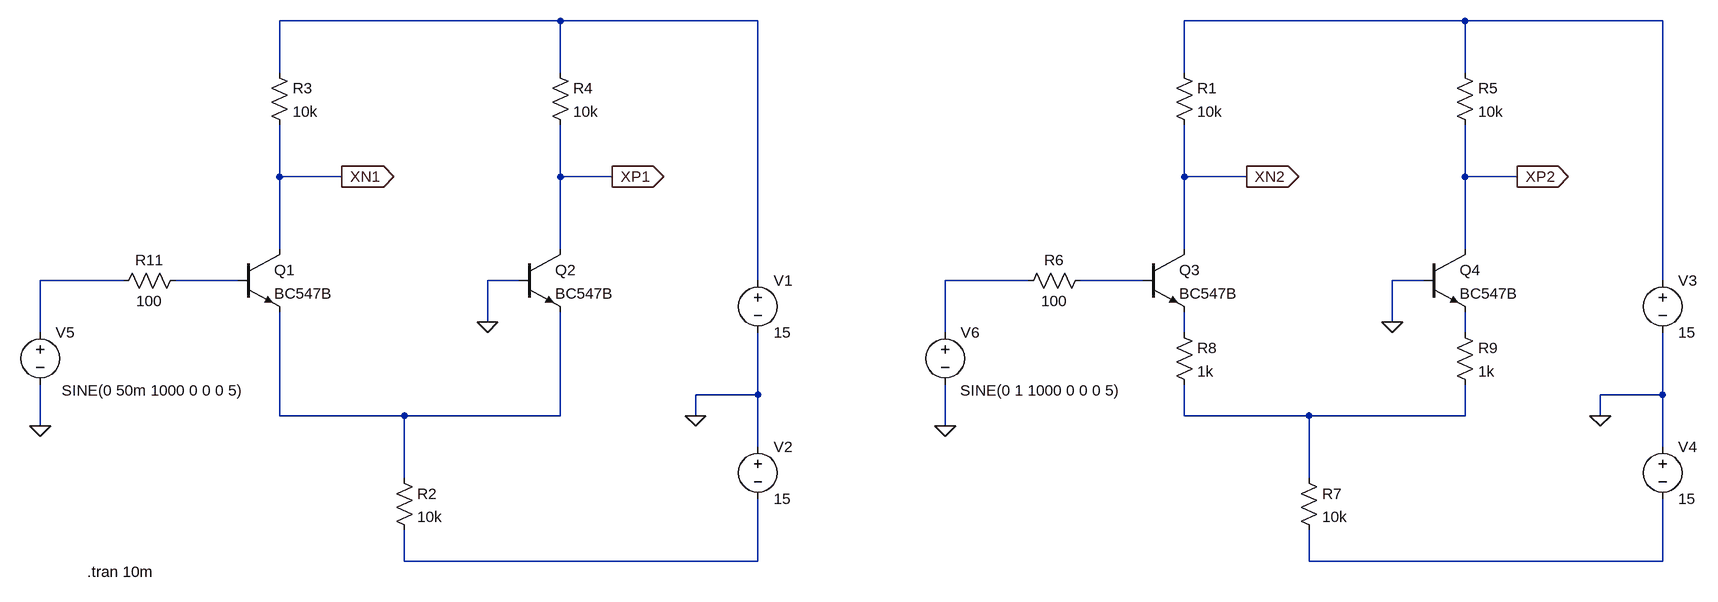
[diagram p0: schematic trans_diff.asc]
trans_diff.asc, the LTspice schematic file:
Version 4
SHEET 1 2616 1076
WIRE 624 -304 192 -304
WIRE 928 -304 624 -304
WIRE 2016 -304 1584 -304
WIRE 2320 -304 2016 -304
WIRE 192 -224 192 -304
WIRE 624 -224 624 -304
WIRE 1584 -224 1584 -304
WIRE 2016 -224 2016 -304
WIRE 192 -64 192 -144
WIRE 288 -64 192 -64
WIRE 624 -64 624 -144
WIRE 704 -64 624 -64
WIRE 1584 -64 1584 -144
WIRE 1680 -64 1584 -64
WIRE 2016 -64 2016 -144
WIRE 2096 -64 2016 -64
WIRE 192 48 192 -64
WIRE 624 48 624 -64
WIRE 1584 48 1584 -64
WIRE 2016 48 2016 -64
WIRE -48 96 -176 96
WIRE 128 96 32 96
WIRE 560 96 512 96
WIRE 928 96 928 -304
WIRE 1344 96 1216 96
WIRE 1520 96 1424 96
WIRE 1952 96 1904 96
WIRE 2320 96 2320 -304
WIRE 512 160 512 96
WIRE 1904 160 1904 96
WIRE -176 176 -176 96
WIRE 1216 176 1216 96
WIRE 1584 176 1584 144
WIRE 2016 176 2016 144
WIRE 928 272 928 176
WIRE 928 272 832 272
WIRE 2320 272 2320 176
WIRE 2320 272 2224 272
WIRE 192 304 192 144
WIRE 384 304 192 304
WIRE 624 304 624 144
WIRE 624 304 384 304
WIRE 832 304 832 272
WIRE 1584 304 1584 256
WIRE 1776 304 1584 304
WIRE 2016 304 2016 256
WIRE 2016 304 1776 304
WIRE 2224 304 2224 272
WIRE -176 320 -176 256
WIRE 1216 320 1216 256
WIRE 928 352 928 272
WIRE 2320 352 2320 272
WIRE 384 400 384 304
WIRE 1776 400 1776 304
WIRE 384 528 384 480
WIRE 928 528 928 432
WIRE 928 528 384 528
WIRE 1776 528 1776 480
WIRE 2320 528 2320 432
WIRE 2320 528 1776 528
FLAG 832 304 0
FLAG 512 160 0
FLAG -176 320 0
FLAG 704 -64 XP1
IOPIN 704 -64 Out
FLAG 288 -64 XN1
IOPIN 288 -64 Out
FLAG 2224 304 0
FLAG 1904 160 0
FLAG 1216 320 0
FLAG 1680 -64 XN2
IOPIN 1680 -64 Out
FLAG 2096 -64 XP2
IOPIN 2096 -64 Out
SYMBOL npn 128 48 R0
SYMATTR InstName Q1
SYMATTR Value BC547B
SYMBOL npn 560 48 R0
SYMATTR InstName Q2
SYMATTR Value BC547B
SYMBOL res 176 -240 R0
SYMATTR InstName R3
SYMATTR Value 10k
SYMBOL res 608 -240 R0
SYMATTR InstName R4
SYMATTR Value 10k
SYMBOL voltage 928 80 R0
WINDOW 123 0 0 Left 0
WINDOW 39 0 0 Left 0
SYMATTR InstName V1
SYMATTR Value 15
SYMBOL voltage 928 336 R0
WINDOW 123 0 0 Left 0
WINDOW 39 0 0 Left 0
SYMATTR InstName V2
SYMATTR Value 15
SYMBOL res -64 112 R270
WINDOW 0 32 56 VTop 2
WINDOW 3 0 56 VBottom 2
SYMATTR InstName R11
SYMATTR Value 100
SYMBOL voltage -176 160 R0
WINDOW 123 0 0 Left 0
WINDOW 39 0 0 Left 0
WINDOW 3 33 105 Left 2
SYMATTR Value SINE(0 50m 1000 0 0 0 5)
SYMATTR InstName V5
SYMBOL res 368 384 R0
SYMATTR InstName R2
SYMATTR Value 10k
SYMBOL npn 1520 48 R0
SYMATTR InstName Q3
SYMATTR Value BC547B
SYMBOL npn 1952 48 R0
SYMATTR InstName Q4
SYMATTR Value BC547B
SYMBOL res 1568 -240 R0
SYMATTR InstName R1
SYMATTR Value 10k
SYMBOL res 2000 -240 R0
SYMATTR InstName R5
SYMATTR Value 10k
SYMBOL voltage 2320 80 R0
WINDOW 123 0 0 Left 0
WINDOW 39 0 0 Left 0
SYMATTR InstName V3
SYMATTR Value 15
SYMBOL voltage 2320 336 R0
WINDOW 123 0 0 Left 0
WINDOW 39 0 0 Left 0
SYMATTR InstName V4
SYMATTR Value 15
SYMBOL res 1328 112 R270
WINDOW 0 32 56 VTop 2
WINDOW 3 0 56 VBottom 2
SYMATTR InstName R6
SYMATTR Value 100
SYMBOL voltage 1216 160 R0
WINDOW 123 0 0 Left 0
WINDOW 39 0 0 Left 0
WINDOW 3 23 105 Left 2
SYMATTR Value SINE(0 1 1000 0 0 0 5)
SYMATTR InstName V6
SYMBOL res 1760 384 R0
SYMATTR InstName R7
SYMATTR Value 10k
SYMBOL res 1568 160 R0
SYMATTR InstName R8
SYMATTR Value 1k
SYMBOL res 2000 160 R0
SYMATTR InstName R9
SYMATTR Value 1k
TEXT -104 544 Left 2 !.tran 10m

The netlist it stands for:
* trans_diff.asc
Q1 XN1 N004 N009 0 BC547B
Q2 XP1 0 N009 0 BC547B
R3 N001 XN1 10k
R4 N001 XP1 10k
V1 N001 0 15
V2 0 N011 15
R11 N003 N004 100
V5 N003 0 SINE(0 50m 1000 0 0 0 5)
R2 N009 N011 10k
Q3 XN2 N006 N007 0 BC547B
Q4 XP2 0 N008 0 BC547B
R1 N002 XN2 10k
R5 N002 XP2 10k
V3 N002 0 15
V4 0 N012 15
R6 N005 N006 100
V6 N005 0 SINE(0 1 1000 0 0 0 5)
R7 N010 N012 10k
R8 N007 N010 1k
R9 N008 N010 1k
.model NPN NPN
.model PNP PNP
.lib standard.bjt
.tran 10m
.backanno
.end